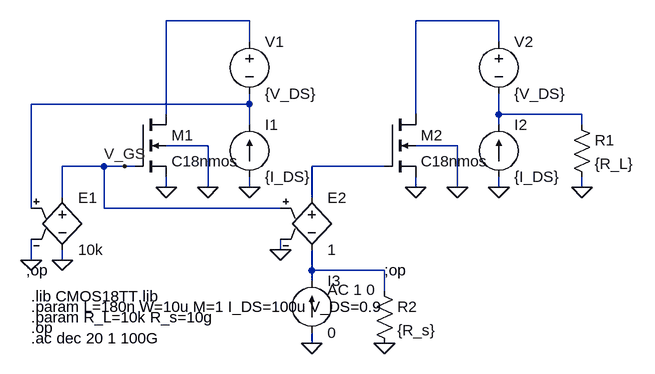
[diagram p0: schematic LTspiceCSstage.asc]
LTspiceCSstage.asc, the LTspice schematic file:
Version 4
SHEET 1 900 680
WIRE 0 -544 -128 -544
WIRE 384 -544 256 -544
WIRE 0 -512 0 -544
WIRE 384 -512 384 -544
WIRE 0 -416 0 -432
WIRE 0 -416 -336 -416
WIRE -128 -400 -128 -544
WIRE 256 -400 256 -544
WIRE 384 -400 384 -432
WIRE 512 -400 384 -400
WIRE 0 -384 0 -416
WIRE 384 -384 384 -400
WIRE 512 -384 512 -400
WIRE -64 -352 -128 -352
WIRE 320 -352 256 -352
WIRE -224 -320 -288 -320
WIRE -192 -320 -224 -320
WIRE -176 -320 -192 -320
WIRE 208 -320 96 -320
WIRE -128 -288 -128 -304
WIRE -64 -288 -64 -352
WIRE 0 -288 0 -304
WIRE 256 -288 256 -304
WIRE 320 -288 320 -352
WIRE 384 -288 384 -304
WIRE 512 -288 512 -304
WIRE -288 -272 -288 -320
WIRE 96 -272 96 -320
WIRE -336 -256 -336 -416
WIRE -224 -256 -224 -320
WIRE 48 -256 -224 -256
WIRE 48 -192 48 -208
WIRE -336 -176 -336 -208
WIRE -288 -176 -288 -192
WIRE 96 -160 96 -192
WIRE 208 -160 96 -160
WIRE 96 -144 96 -160
WIRE 208 -128 208 -160
WIRE 96 -48 96 -64
FLAG -64 -288 0
FLAG -128 -288 0
FLAG -288 -176 0
FLAG 0 -288 0
FLAG -336 -176 0
FLAG -192 -320 V_GS
FLAG 320 -288 0
FLAG 256 -288 0
FLAG 384 -288 0
FLAG 48 -192 0
FLAG 512 -288 0
FLAG 96 -48 0
FLAG 208 -48 0
DATAFLAG -336 -416 ""
DATAFLAG -272 -320 ""
DATAFLAG 112 -320 ""
DATAFLAG 496 -400 ""
SYMBOL nmos4 -176 -400 R0
SYMATTR InstName M1
SYMATTR Value C18nmos
SYMATTR Value2 l={L} w={W} m={m}
SYMBOL e -288 -288 R0
SYMATTR InstName E1
SYMATTR Value 10k
SYMBOL voltage 0 -528 R0
SYMATTR InstName V1
SYMATTR Value {V_DS}
SYMBOL current 0 -304 M180
WINDOW 0 24 80 Left 2
WINDOW 3 24 0 Left 2
SYMATTR InstName I1
SYMATTR Value {I_DS}
SYMBOL nmos4 208 -400 R0
SYMATTR InstName M2
SYMATTR Value C18nmos
SYMATTR Value2 l={L} w={W} ad={w*500n} as={w*500n} pd={2*w+1u} ps={2*w+1u} m={m}
SYMBOL e 96 -288 R0
SYMATTR InstName E2
SYMATTR Value 1
SYMBOL voltage 384 -528 R0
SYMATTR InstName V2
SYMATTR Value {V_DS}
SYMBOL current 384 -304 M180
WINDOW 0 24 80 Left 2
WINDOW 3 24 0 Left 2
SYMATTR InstName I2
SYMATTR Value {I_DS}
SYMBOL res 496 -400 R0
SYMATTR InstName R1
SYMATTR Value {R_L}
SYMBOL current 96 -64 M180
WINDOW 0 24 80 Left 2
WINDOW 3 24 0 Left 2
WINDOW 123 24 66 Left 2
WINDOW 39 0 0 Left 0
SYMATTR InstName I3
SYMATTR Value 0
SYMATTR Value2 AC 1 0
SYMBOL res 192 -144 R0
SYMATTR InstName R2
SYMATTR Value {R_s}
TEXT -336 -104 Left 2 !.param L=180n W=10u M=1 I_DS=100u V_DS=0.9
TEXT -344 -160 Left 2 !;op
TEXT -336 -120 Left 2 !.lib CMOS18TT.lib
TEXT 208 -160 Left 2 !;op
TEXT -336 -88 Left 2 !.param R_L=10k R_s=10g
TEXT -336 -72 Left 2 !.op
TEXT -336 -56 Left 2 !.ac dec 20 1 100G

The netlist it stands for:
* LTspiceCSstage.asc
M1 N001 V_GS 0 0 C18nmos l={L} w={W} m={m}
E1 V_GS 0 N003 0 10k
V1 N001 N003 {V_DS}
I1 0 N003 {I_DS}
M2 N002 N005 0 0 C18nmos l={L} w={W} ad={w*500n} as={w*500n} pd={2*w+1u} ps={2*w+1u} m={m}
E2 N005 N006 V_GS 0 1
V2 N002 N004 {V_DS}
I2 0 N004 {I_DS}
R1 N004 0 {R_L}
I3 0 N006 0 AC 1 0
R2 N006 0 {R_s}
.model NMOS NMOS
.model PMOS PMOS
.lib standard.mos
.param L=180n W=10u M=1 I_DS=100u V_DS=0.9
;op
.lib CMOS18TT.lib
;op
.param R_L=10k R_s=10g
.op
.ac dec 20 1 100G
.backanno
.end